# EAGLE design rover board-4 (EAGLE 5.11)
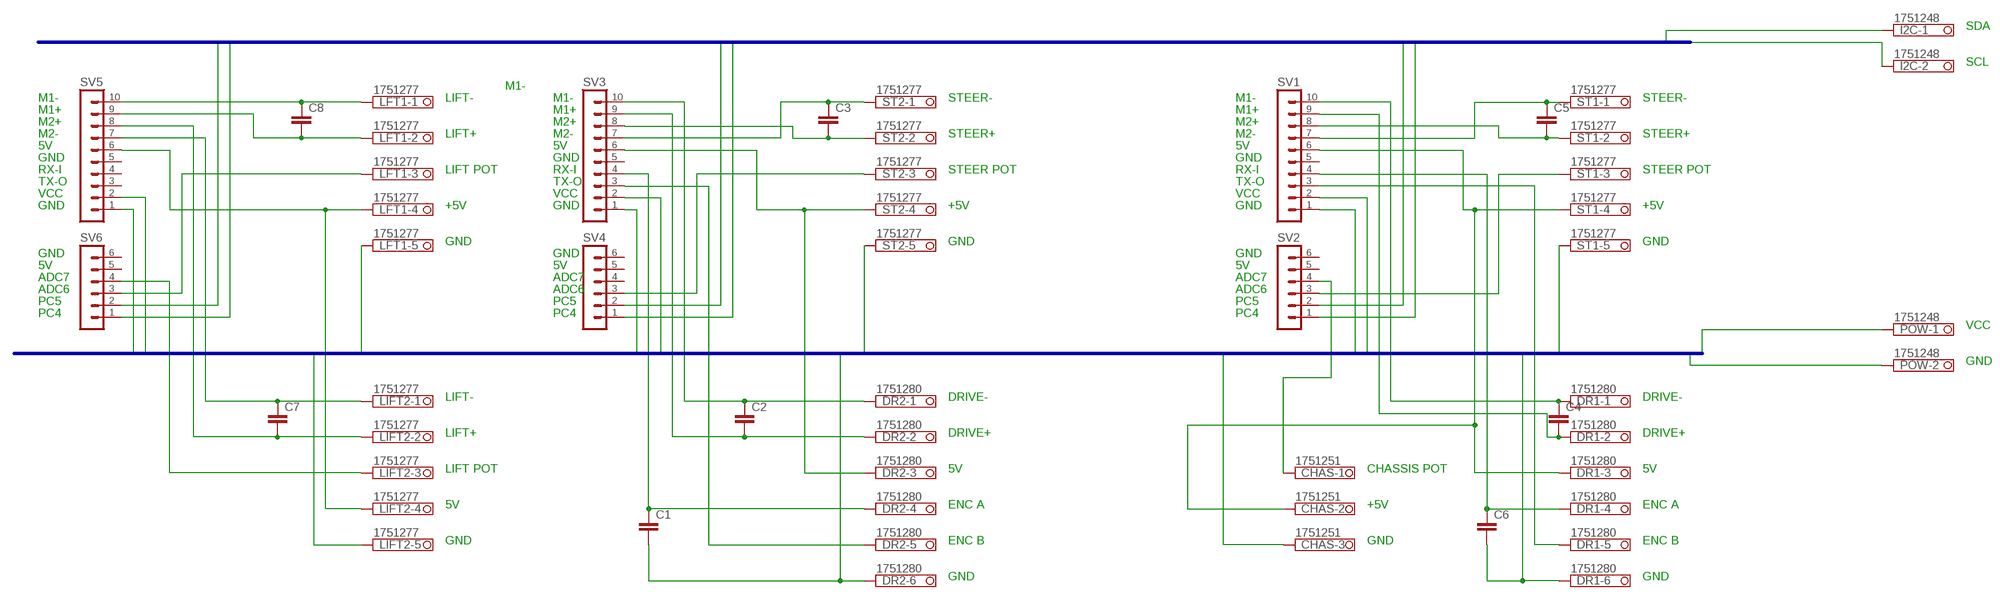
[diagram p0: schematic, sheet 1]

## Parts
C1  C2.5/2  [C2.5-2]
C2  C2.5/2  [C2.5-2]
C3  C2.5/2  [C2.5-2]
C4  C2.5/2  [C2.5-2]
C5  C2.5/2  [C2.5-2]
C6  C2.5/2  [C2.5-2]
C7  C2.5/2  [C2.5-2]
C8  C2.5/2  [C2.5-2]
CHAS  1751251  [1751251]
DR1  1751280  [1751280]
DR2  1751280  [1751280]
I2C  1751248  [1751248]
LFT1  1751277  [1751277]
LIFT2  1751277  [1751277]
POW  1751248  [1751248]
ST1  1751277  [1751277]
ST2  1751277  [1751277]
SV1  MA10-1  [MA10-1]
SV2  MA06-1  [MA06-1]
SV3  MA10-1  [MA10-1]
SV4  MA06-1  [MA06-1]
SV5  MA10-1  [MA10-1]
SV6  MA06-1  [MA06-1]

## Nets
GND: C1.2 C6.2 CHAS.3 DR1.6 DR2.6 LFT1.5 LIFT2.5 POW.2 ST1.5 ST2.5 SV1.1 SV3.1 SV5.1
N$1: C8.1 LFT1.1 SV5.10
N$2: C8.2 LFT1.2 SV5.9
N$3: C7.1 LIFT2.1 SV5.7
N$4: C7.2 LIFT2.2 SV5.8
N$5: LFT1.3 SV6.3
N$6: LIFT2.3 SV6.4
N$7: LFT1.4 LIFT2.4 SV5.6
N$8: C3.1 ST2.1 SV3.7
N$9: C2.2 DR2.2 SV3.9
N$10: C2.1 DR2.1 SV3.10
N$11: C3.2 ST2.2 SV3.8
N$12: ST2.3 SV4.3
N$13: DR2.3 ST2.4 SV3.6
N$14: C1.1 DR2.4 SV3.4
N$15: DR2.5 SV3.3
N$16: ST1.3 SV2.3
N$17: CHAS.2 DR1.3 ST1.4 SV1.6
N$18: DR1.5 SV1.3
N$19: C4.1 DR1.1 SV1.10
N$20: C4.2 DR1.2 SV1.9
N$21: C5.1 ST1.1 SV1.7
N$22: C5.2 ST1.2 SV1.8
N$23: C6.1 DR1.4 SV1.4
N$25: CHAS.1 SV2.4
SCL: I2C.2 SV2.2 SV4.2 SV6.2
SDA: I2C.1 SV2.1 SV4.1 SV6.1
VCC: POW.1 SV1.2 SV3.2 SV5.2
Unconnected: SV1.5 SV2.5 SV2.6 SV3.5 SV4.4 SV4.5 SV4.6 SV5.3 SV5.4 SV5.5 SV6.5 SV6.6

## Buses
POWER:VCC,GND
I2C:SDA,SCL

## Notes on the sheet
- SDA
- SCL
- M1-
- M1- | LIFT- | M1- | STEER- | M1- | STEER-
- M1+ | M1+ | M1+
- M2+ | M2+ | M2+
- M2- | LIFT+ | M2- | STEER+ | M2- | STEER+
- 5V | 5V | 5V
- GND | GND | GND
- RX-I | LIFT POT | RX-I | STEER POT | RX-I | STEER POT
- TX-O | TX-O | TX-O
- VCC | VCC | VCC
- GND | +5V | GND | +5V | GND | +5V
- GND | GND | GND
- GND | GND | GND
- 5V | 5V | 5V
- ADC7 | ADC7 | ADC7
- ADC6 | ADC6 | ADC6
- PC5 | PC5 | PC5
- PC4 | PC4 | PC4
- VCC
- GND
- LIFT- | DRIVE- | DRIVE-
- LIFT+ | DRIVE+ | DRIVE+
- LIFT POT | 5V | CHASSIS POT | 5V
- 5V | ENC A | +5V | ENC A
- GND | ENC B | GND | ENC B
- GND | GND

## Library data of the parts
C1-C8 = capacitor-wima:C: CAPACITOR naming: grid - package width
CHAS = con-phoenix-350:1751251: MKDS 1/ 3-3,5 Printklemme Nennstrom: 10 A Bemessungsspannung: 160 V Raster: 3,5 mm Polzahl: 3 Montageart: Löten Anschlussart: Schraubanschluss Anschlussrichtung vom Leiter zur Platine: 0° Source: http://eshop.phoenixcontact.com .. 1751251.pdf; OC_FARNELL: unknown; OC_NEWARK: unknown
DR1 DR2 = con-phoenix-350:1751280: MKDS 1/ 6-3,5 Printklemme Nennstrom: 10 A Bemessungsspannung: 160 V Raster: 3,5 mm Polzahl: 6 Montageart: Löten Anschlussart: Schraubanschluss Anschlussrichtung vom Leiter zur Platine: 0° Source: http://eshop.phoenixcontact.com .. 1751280.pdf; MPN: 1751280; OC_FARNELL: unknown; OC_NEWARK: 27R1765
I2C POW = con-phoenix-350:1751248: MKDS 1/ 2-3,5 Printklemme Nennstrom: 10 A Bemessungsspannung: 160 V Raster: 3,5 mm Polzahl: 2 Montageart: Löten Anschlussart: Schraubanschluss Anschlussrichtung vom Leiter zur Platine: 0° Source: http://eshop.phoenixcontact.com .. 1751248.pdf; OC_FARNELL: unknown; OC_NEWARK: unknown
LFT1 LIFT2 ST1 ST2 = con-phoenix-350:1751277: MKDS 1/ 5-3,5 Printklemme Nennstrom: 10 A Bemessungsspannung: 160 V Raster: 3,5 mm Polzahl: 5 Montageart: Löten Anschlussart: Schraubanschluss Anschlussrichtung vom Leiter zur Platine: 0° Source: http://eshop.phoenixcontact.com .. 1751277.pdf; OC_FARNELL: unknown; OC_NEWARK: unknown
SV1 SV3 SV5 = con-lstb:MA10-1: PIN HEADER; OC_FARNELL: unknown; OC_NEWARK: unknown
SV2 SV4 SV6 = con-lstb:MA06-1: PIN HEADER; OC_FARNELL: unknown; OC_NEWARK: unknown

## Board
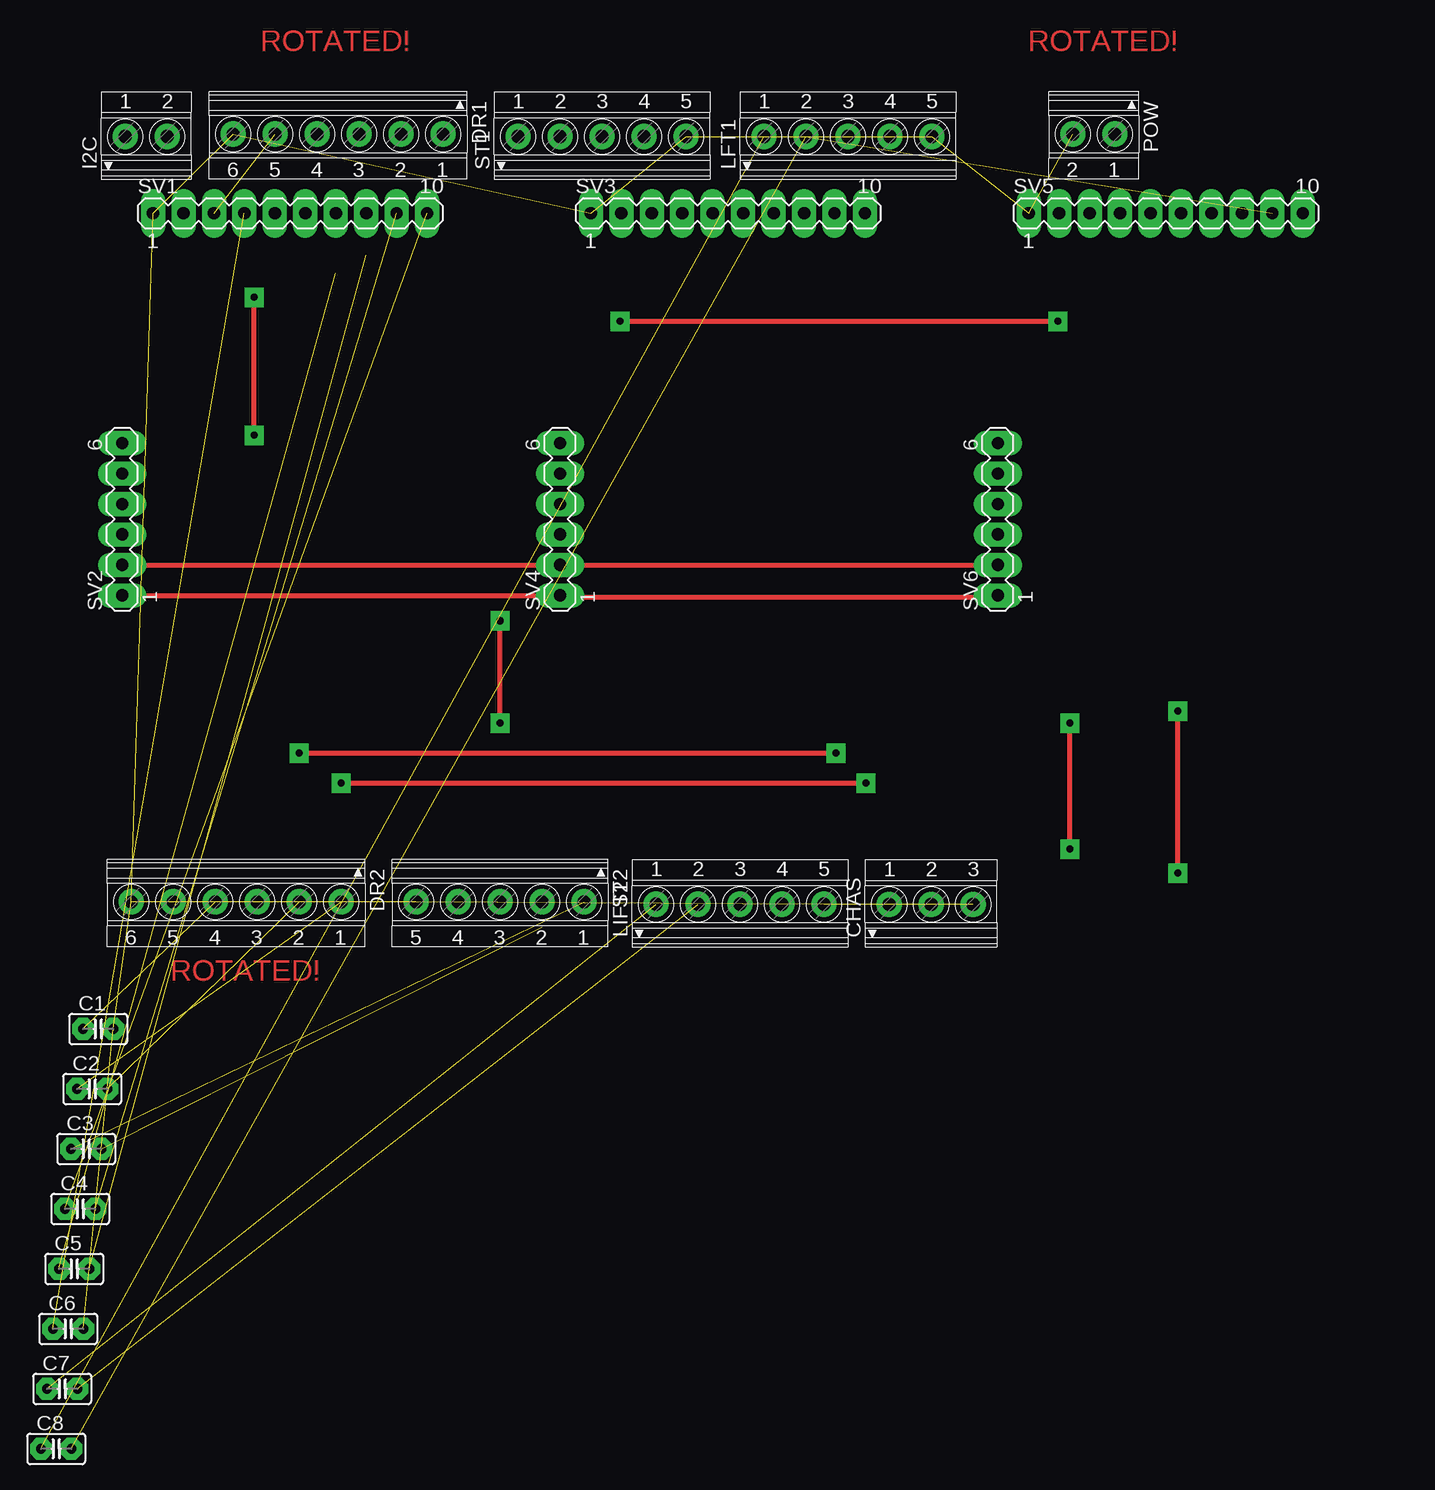
[diagram p1: board, top side]
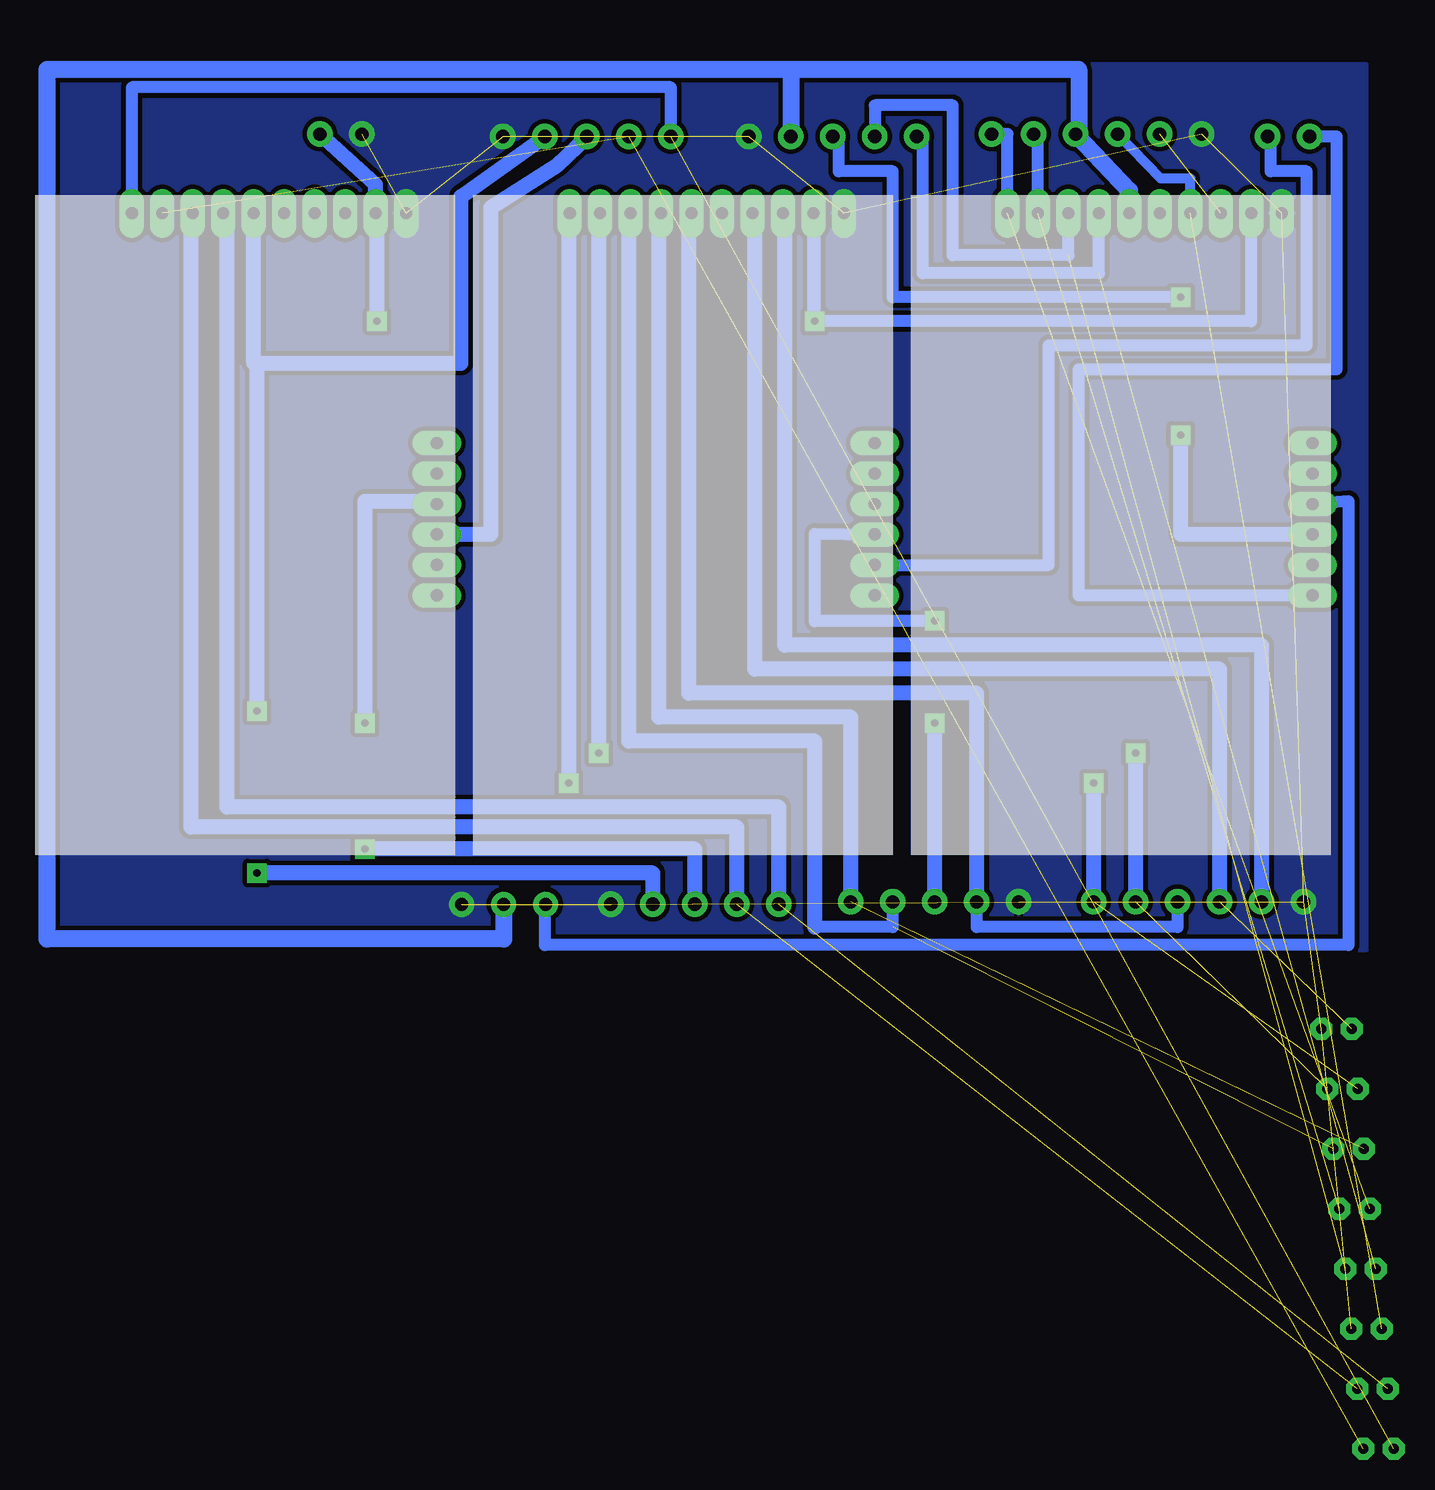
[diagram p2: board, bottom side, seen from below]

No outline drawn. Coordinates in mm, seen from the top.
Copper layers (1*16): Top 0.035mm / dielectric 1.5mm / Bottom 0.035mm
Design rules "default *": minimum track width 10mil, minimum drill 24mil, track to track 15mil, track to pad 15mil, pad to pad 8mil, via to via 8mil, smd to smd 8mil, copper to edge 40mil, drill to drill 8mil, minimum pad ring 20mil, minimum via ring 20mil, stop-mask expansion 4mil, vias tented up to drill 0mil, thermal gap 0mil

### Footprints (pad centres in the part's own frame; a part is rotated, then mirrored left to right if it is on the bottom)
C2.5-2 = drill 0.813 pad 1.6 octagon: 1 -1.27,0; 2 1.27,0
1751251 = drill 1.1 pad 1.7 round: 1 -3.5,-0.1; 2 0,-0.1; 3 3.5,-0.1
1751280 = drill 1.1 pad 1.7 round: 1 -8.75,-0.1; 2 -5.25,-0.1; 3 -1.75,-0.1; 4 1.75,-0.1; 5 5.25,-0.1; 6 8.75,-0.1
1751248 = drill 1.1 pad 1.7 round: 1 -1.75,-0.1; 2 1.75,-0.1
1751277 = drill 1.1 pad 1.7 round: 1 -7,-0.1; 2 -3.5,-0.1; 3 0,-0.1; 4 3.5,-0.1; 5 7,-0.1
MA10-1 = drill 1.016 long: 1 -11.43,0; 2 -8.89,0; 3 -6.35,0; 4 -3.81,0; 5 -1.27,0; 6 1.27,0; 7 3.81,0; 8 6.35,0; 9 8.89,0; 10 11.43,0
MA06-1 = drill 1.016 long: 1 -6.35,0; 2 -3.81,0; 3 -1.27,0; 4 1.27,0; 5 3.81,0; 6 6.35,0

### Placement (x,y rotation side)
C1  2.5,-6.5 0 top
C2  2,-11.5 0 top
C3  1.5,-16.5 0 top
C4  1,-21.5 0 top
C5  0.5,-26.5 0 top
C6  0,-31.5 0 top
C7  -0.5,-36.5 0 top
C8  -1,-41.5 0 top
CHAS  71.94,3.98 0 top
DR1  22.5,68 180 top
DR2  14,4 180 top
I2C  6.5,68 0 top
LFT1  65,68 0 top
LIFT2  56,4 0 top
POW  85.5,68 180 top
ST1  44.5,68 0 top
ST2  36,4 180 top
SV1  18.5,61.5 0 top
SV2  4.5,36 90 top
SV3  55,61.5 0 top
SV4  41,36 90 top
SV5  91.5,61.5 0 top
SV6  77.5,36 90 top

### Tracks (layer width: path | path; a pad name or v marks a point on that pad's centre or on a via)
GND  (12 unrouted)
  pour Bottom: 0,0 111,0 111,74 0,74
N$1  (1 unrouted)
  Bottom 1.016: LFT1.1 58,72 102.93,72 SV5.10
N$2  (2 unrouted)
N$3  (1 unrouted)
  Bottom 1.016: 95,61.5 SV5.7
  Bottom 1.27: 95,61.5 95,12 49,12 LIFT2.1
N$4  (1 unrouted)
  Bottom 1.016: 98,61.5 SV5.8
  Bottom 1.27: 98,61.5 98,10.34 52.5,10.34 LIFT2.2
N$5
  Bottom 1.27: SV6.3 73,34.73 73,62 67.5,65.5 LFT1.3
N$6  (via drill 0.6)
  Top 0.406: v83.5,8.5 v83.5,19
  Bottom 1.016: 77.5,37.5 SV6.4
  Bottom 1.27: LIFT2.3 56,8.5 v83.5,8.5 | v83.5,19 83.5,37.5 77.5,37.5
N$7  (via drill 0.6)
  Top 0.406: v92.5,6.5 v92.5,20
  Bottom 1.016: 92.5,49 92.77,49
  Bottom 1.27: LFT1.4 75.5,62.9 75.5,49 92.5,49 v92.5,20 | LIFT2.4 59.5,6.5 v92.5,6.5 | 92.77,49 SV5.6
N$8  (1 unrouted)
  Bottom 1.016: 59,61.5 SV3.7
  Bottom 1.27: 59,61.5 59,19.5 43,19.5 ST2.1
N$9  (via drill 0.6)  (1 unrouted)
  Top 0.406: v19.25,16.5 v64,16.5
  Bottom 1.016: 64,61.5 SV3.9
  Bottom 1.27: v64,16.5 64,61.5 | DR2.2 v19.25,16.5
N$10  (via drill 0.6)  (1 unrouted)
  Top 0.406: v22.75,14 v66.5,14
  Bottom 1.016: 66.5,61.5 SV3.10
  Bottom 1.27: v66.5,14 66.5,61.5 | DR2.1 v22.75,14
N$11  (1 unrouted)
  Bottom 1.016: 61.5,61.5 SV3.8 | 46,2 39.5,2 ST2.2
  Bottom 1.27: 61.5,61.5 61.5,17.5 46,17.5 46,2
N$12  (via drill 0.6)
  Top 0.406: v36,19 v36,27.52
  Bottom 1.016: v36,27.52 46,27.5 46,34.8 SV4.3
  Bottom 1.27: ST2.3 v36,19
N$13
  Bottom 1.016: 56.5,61.5 SV3.6 | ST2.4 32.5,2 15.75,2 DR2.3
  Bottom 1.27: 56.5,61.5 56.5,21.5 32.5,21.5 ST2.4
N$14  (1 unrouted)
  Bottom 1.016: 51,61.5 SV3.4
  Bottom 1.27: 51,61.5 51,23.5 12.25,23.5 DR2.4
N$15
  Bottom 1.016: 48.5,61.5 SV3.3
  Bottom 1.27: 48.5,61.5 48.5,25.5 8.75,25.5 DR2.5
N$16  (via drill 0.6)
  Top 0.406: v15.5,43 v15.5,54.5
  Bottom 1.016: ST1.3 44,67.9 44,65 39.5,65 39.5,54.5 v15.5,54.5 | SV2.3
  Bottom 1.27: v15.5,43 15.5,34.73 SV2.3
N$17
  Bottom 1.422: SV1.6 19.77,63.4 DR1.3 24,67.9 24,73.5 48,73.5 | 48,73.5 ST1.4 | 48,73.5 110,73.5 110,1 71.94,1 CHAS.2
N$18  (1 unrouted)
N$19  (1 unrouted)
  Bottom 1.016: DR1.1 29.93,68.1 SV1.10
N$20  (1 unrouted)
  Bottom 1.016: DR1.2 27.39,68.1 SV1.9
N$21  (1 unrouted)
  Bottom 1.016: ST1.1 37,67.9 37,56.5 22.31,56.5 SV1.7
N$22  (1 unrouted)
  Bottom 1.016: ST1.2 41,70.5 34.5,70.5 34.5,58 24.85,58 SV1.8
N$23  (1 unrouted)
  Bottom 0.813: DR1.4 17.16,64.39 14.69,64.4 SV1.4
N$25
  Bottom 1.016: CHAS.1 68.5,3.88 68.5,0.5 1.5,0.5 1.5,37.5 SV2.4
SCL
  Top 0.406: SV2.2 SV4.2 SV6.2
  Bottom 1.016: I2C.2 8,67.9 8,65 5,65 5,50.5 26.5,50.5 26.5,32.19 SV4.2
SDA
  Top 0.406: 41,29.5 78,29.5 | SV2.1 SV4.1
  Top 1.016: SV6.1 78,29.65 78,29.5 | SV4.1 41,29.5
  Bottom 1.016: I2C.1 2.5,67.9 2.5,48.5 24,48.5 24,29.65 SV2.1
VCC  (via drill 0.6)
  Top 0.406: v46,52.5 v82.5,52.5
  Top 1.016: v82.5,61.5 SV5.2 | v46,61.5 SV3.2
  Bottom 1.016: v46,52.5 46.11,53.5 SV3.2 | v46,52.5 v46,61.5 | SV1.2 9.61,52.5 v46,52.5
  Bottom 1.27: POW.1 82.61,63.9 SV5.2 | v82.5,52.5 v82.5,61.5

### Text on the board
Top: ROTATED! | ROTATED! | ROTATED!